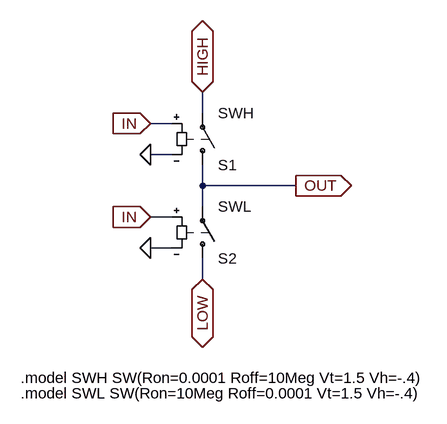
[diagram p0: schematic push_pull.asc]
push_pull.asc, the LTspice schematic file:
Version 4
SHEET 1 880 680
WIRE 112 16 112 -16
WIRE 64 32 32 32
WIRE 64 80 32 80
WIRE 112 128 112 96
WIRE 256 128 112 128
WIRE 112 160 112 128
WIRE 64 176 32 176
WIRE 64 224 32 224
WIRE 112 272 112 240
FLAG 256 128 OUT
IOPIN 256 128 Out
FLAG 32 224 0
FLAG 32 80 0
FLAG 32 32 IN
IOPIN 32 32 In
FLAG 32 176 IN
IOPIN 32 176 In
FLAG 112 272 LOW
IOPIN 112 272 BiDir
FLAG 112 -16 HIGH
IOPIN 112 -16 BiDir
SYMBOL sw 112 112 M180
SYMATTR InstName S1
SYMATTR Value SWH
SYMBOL sw 112 256 M180
SYMATTR InstName S2
SYMATTR Value SWL
TEXT -168 424 Left 2 !.model SWH SW(Ron=0.0001 Roff=10Meg Vt=1.5 Vh=-.4)
TEXT -168 448 Left 2 !.model SWL SW(Ron=10Meg Roff=0.0001 Vt=1.5 Vh=-.4)

The netlist it stands for:
* push_pull.asc
S1 OUT HIGH IN 0 SWH
S2 LOW OUT IN 0 SWL
.model SWH SW(Ron=0.0001 Roff=10Meg Vt=1.5 Vh=-.4)
.model SWL SW(Ron=10Meg Roff=0.0001 Vt=1.5 Vh=-.4)
.backanno
.end